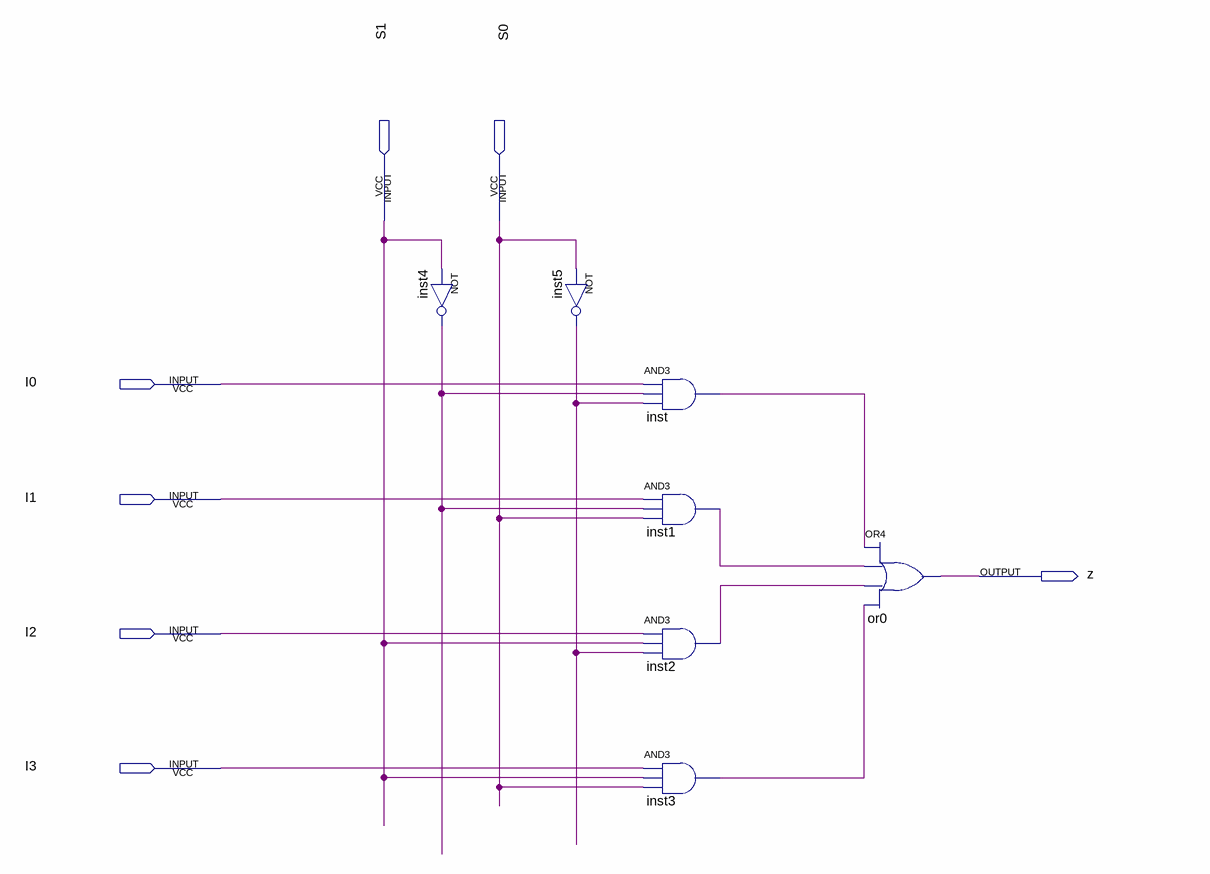
[diagram p0: schematic sheet]
// Quartus schematic DataSelector.bdf as structural Verilog: 7 symbols, 7 pins
module DataSelector (
  input  S1,
  input  S0,
  input  I0,
  input  I1,
  input  I2,
  input  I3,
  output z
);

  wire inst1_out, inst2_out, inst3_out, inst4_out, inst5_out, inst_out;

  not inst4 (inst4_out, S1);
  not inst5 (inst5_out, S0);
  and inst (inst_out, I0, inst4_out, inst5_out);
  and inst1 (inst1_out, I1, inst4_out, S0);
  and inst2 (inst2_out, I2, S1, inst5_out);
  and inst3 (inst3_out, I3, S1, S0);
  or or0 (z, inst_out, inst1_out, inst2_out, inst3_out);
endmodule
